# Altium schematic sheet Power_P3V3.SchDoc
size A4; CompanyName: WEITI ISE; Address1: ul. Nowowiejska 15/19; Address2: 00-665 Warszawa; DocumentNumber: 10; SheetNumber: 10; SheetTotal: 11
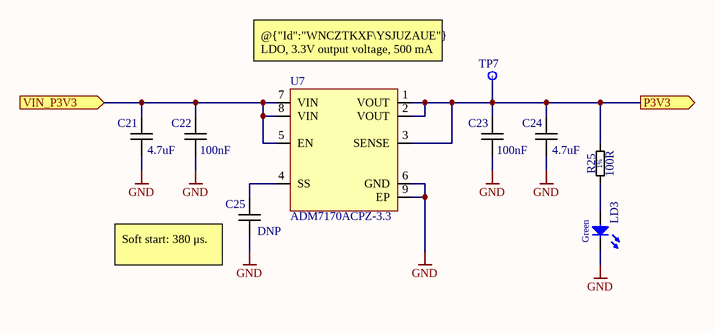
[diagram p0: Power_P3V3.SchDoc]

## Parts
C21  4.7uF  [CAPC0603X90N]
C22  100nF  [CAPC0603X90N]
C23  100nF  [CAPC0603X90N]
C24  4.7uF  [CAPC0603X90N]
C25  DNP  [CAPC0603X90N]
LD3  Green  [LED_0603X60N]
R25  100R  [RESC0603X60N]
TP7  TestPoint  [TESTPOINT_SMD_C1P27MM]  (value not drawn)  (no BOM)
U7  ADM7170ACPZ-3.3  [LFCSP50P300X300X80-9N-D]

## Ports
P3V3 (out), VIN_P3V3 (in)

## Nets
GND: C21.2 C22.2 C23.2 C24.2 C25.2 LD3.1(C) U7.6(GND) U7.9(EP)
P3V3: C23.1 C24.1 R25.2 TP7.1 U7.1(VOUT) U7.2(VOUT) U7.3(SENSE) ; port P3V3
VIN_P3V3: C21.1 C22.1 U7.5(EN) U7.7(VIN) U7.8(VIN) ; port VIN_P3V3
NetC25_1: C25.1 U7.4(SS)
NetLD3_2: LD3.2(A) R25.1

## Notes on the sheet
- @{"Id":"WNCZTKXF\YSJUZAUE"} LDO, 3.3V output voltage, 500 mA maximum output current
- (near C25) Soft start: 380 μs.
- Project:
- Title
- File:
- Drawn by:
- Engineer:
- Checked by:
- Szymon Jedliński
- Sheet:
- Revision:
- Total Sheet:
- 1.0
- Variant:
- Approved by:
- Date:

## Library data of the parts
C21 C24 = CC0603_4U7F_16V_10%_X7R: Non-polarised capacitor; Manufacturer Part Number: GRM188Z71C475KE21D; DesignItemId: CC0603_4U7F_16V_10%_X7R; HelpURL: https://www.mouser.pl/datasheet/2/281/1/GRM188Z71C225KE43_01A-1985990.pdf; Height: 0.8mm; SMD: Yes; Value: 4.7uF
C22 C23 = CC0603_100NF_16V_10%_X7R: Non-polarised capacitor; Manufacturer Part Number: VJ0603Y104KXJCW1BC; DesignItemId: CC0603_100NF_16V_10%_X7R; HelpURL: https://www.vishay.com/docs/28548/vjw1bcbascomseries.pdf; Height: 0.8mm; SMD: Yes; Value: 100nF
C25 = CC0603_DNP: Non-polarised capacitor; Manufacturer Part Number: UNDEFINED; DesignItemId: CC0603_DNP; Height: 0.8mm; SMD: Yes; Value: DNP
LD3 = LED_0603_V_GREEN: SMD mono-color Chip LED, Green, 0603; Manufacturer Part Number: HSME-C191; Manufacturer 1 Component Height: 0.6mm; DesignItemId: LED_0603_V_GREEN; Color: Green; HelpURL: https://www.tme.eu/Document/898384df4a59fb78dfee2d27c6573b7a/HSME-C191.pdf; SMD: Yes
R25 = R0603_100R_0.1W_100PPM: General Purpose Thick Film Chip Resistor; Manufacturer Part Number: 0603SAF1000T5E; Manufacturer 1 Component Height: 0.5mm; Tolerance: 1%; Voltage: 50V; DesignItemId: R0603_100R_0.1W_100PPM; HelpURL: https://www.vishay.com/docs/20035/dcrcwe3.pdf; SMD: Yes; Value: 100R
TP7 = TESTPOINT_SMD_C1P27MM: 1.27mm diameter SMD Test Point Area; DesignItemId: TESTPOINT_SMD_C1P27MM; Family: TestPoint; Part Description: 1.27mm diameter SMD Test Point Area
U7 = ADM7170ACPZ-3.3: 3.3V, 500 mA, Ultralow Noise, High PSRR,Fast Transient Response CMOS LDO, FIXED, LFCSP-8; Manufacturer Part Number: ADM7170ACPZ-3.3-R7; Manufacturer 1 Component Height: 0.8mm; DesignItemId: ADM7170ACPZ-3.3; Device: ADM7170ACPZ-3.3; HelpURL: https://www.analog.com/media/en/technical-documentation/data-sheets/ADM7170.pdf; SMD: Yes